# EAGLE schematic goes-to-11 (EAGLE 7.5.0)

## Sheet 1 of 2
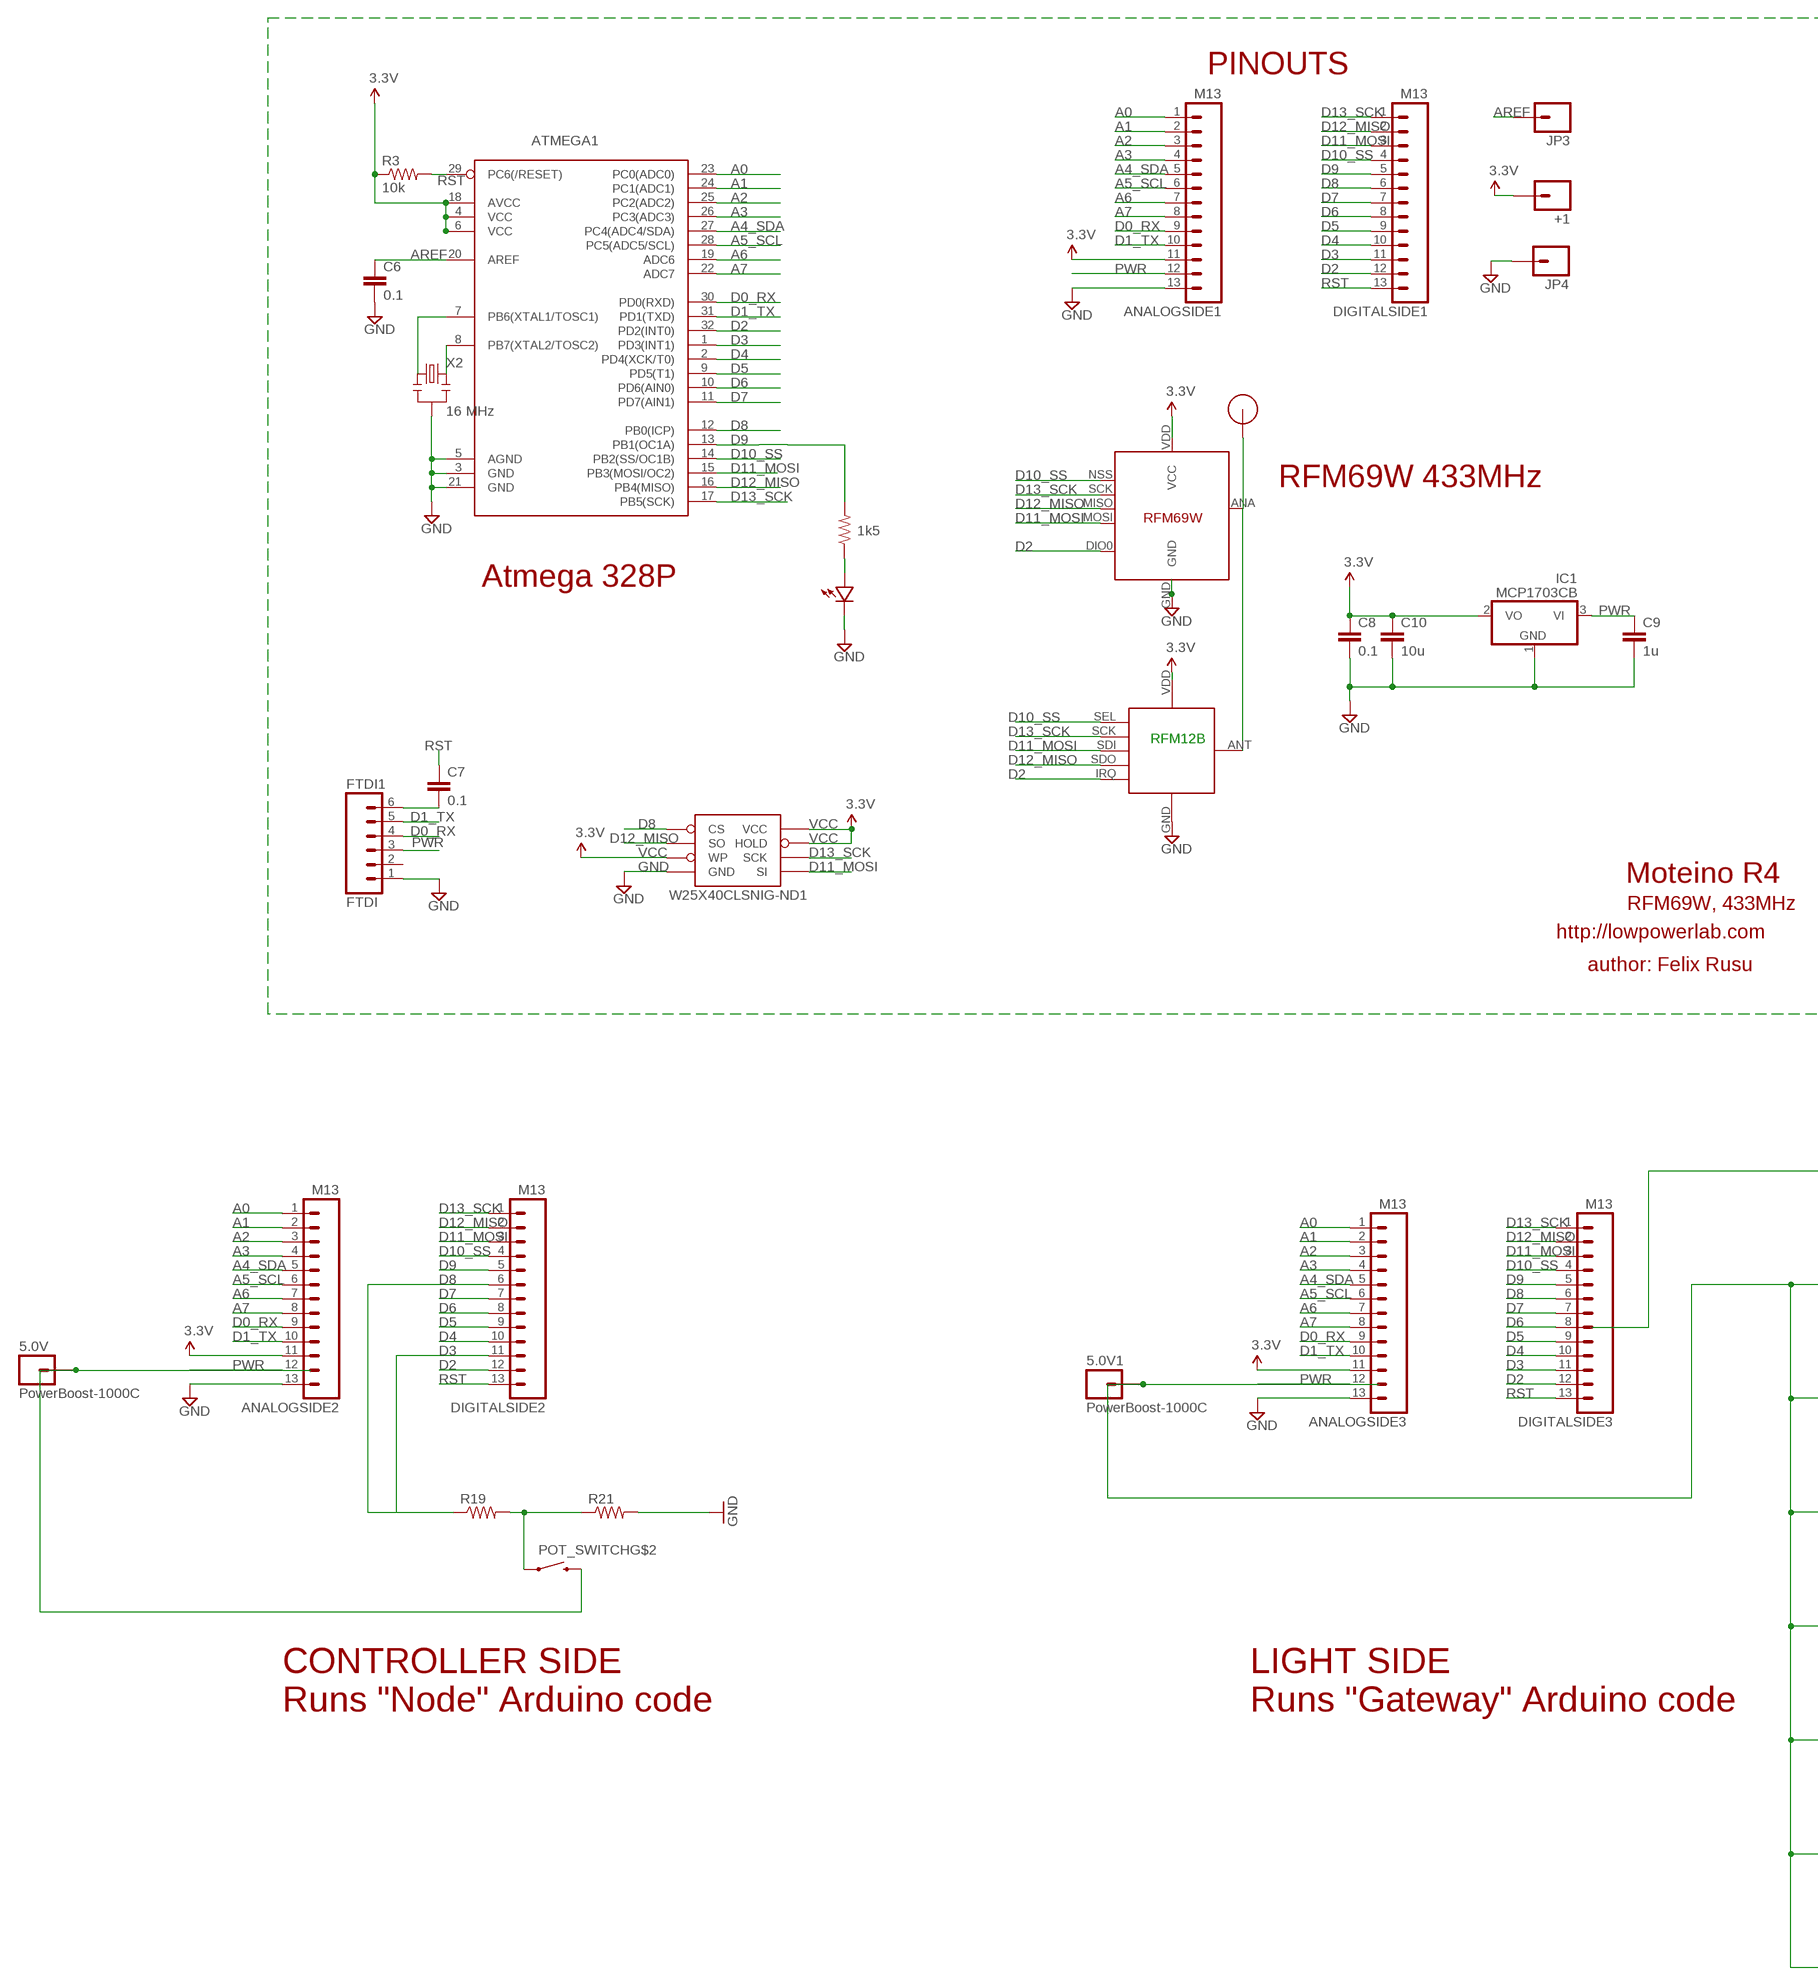
[diagram p0: schematic, sheet 1, part 1 of 2]
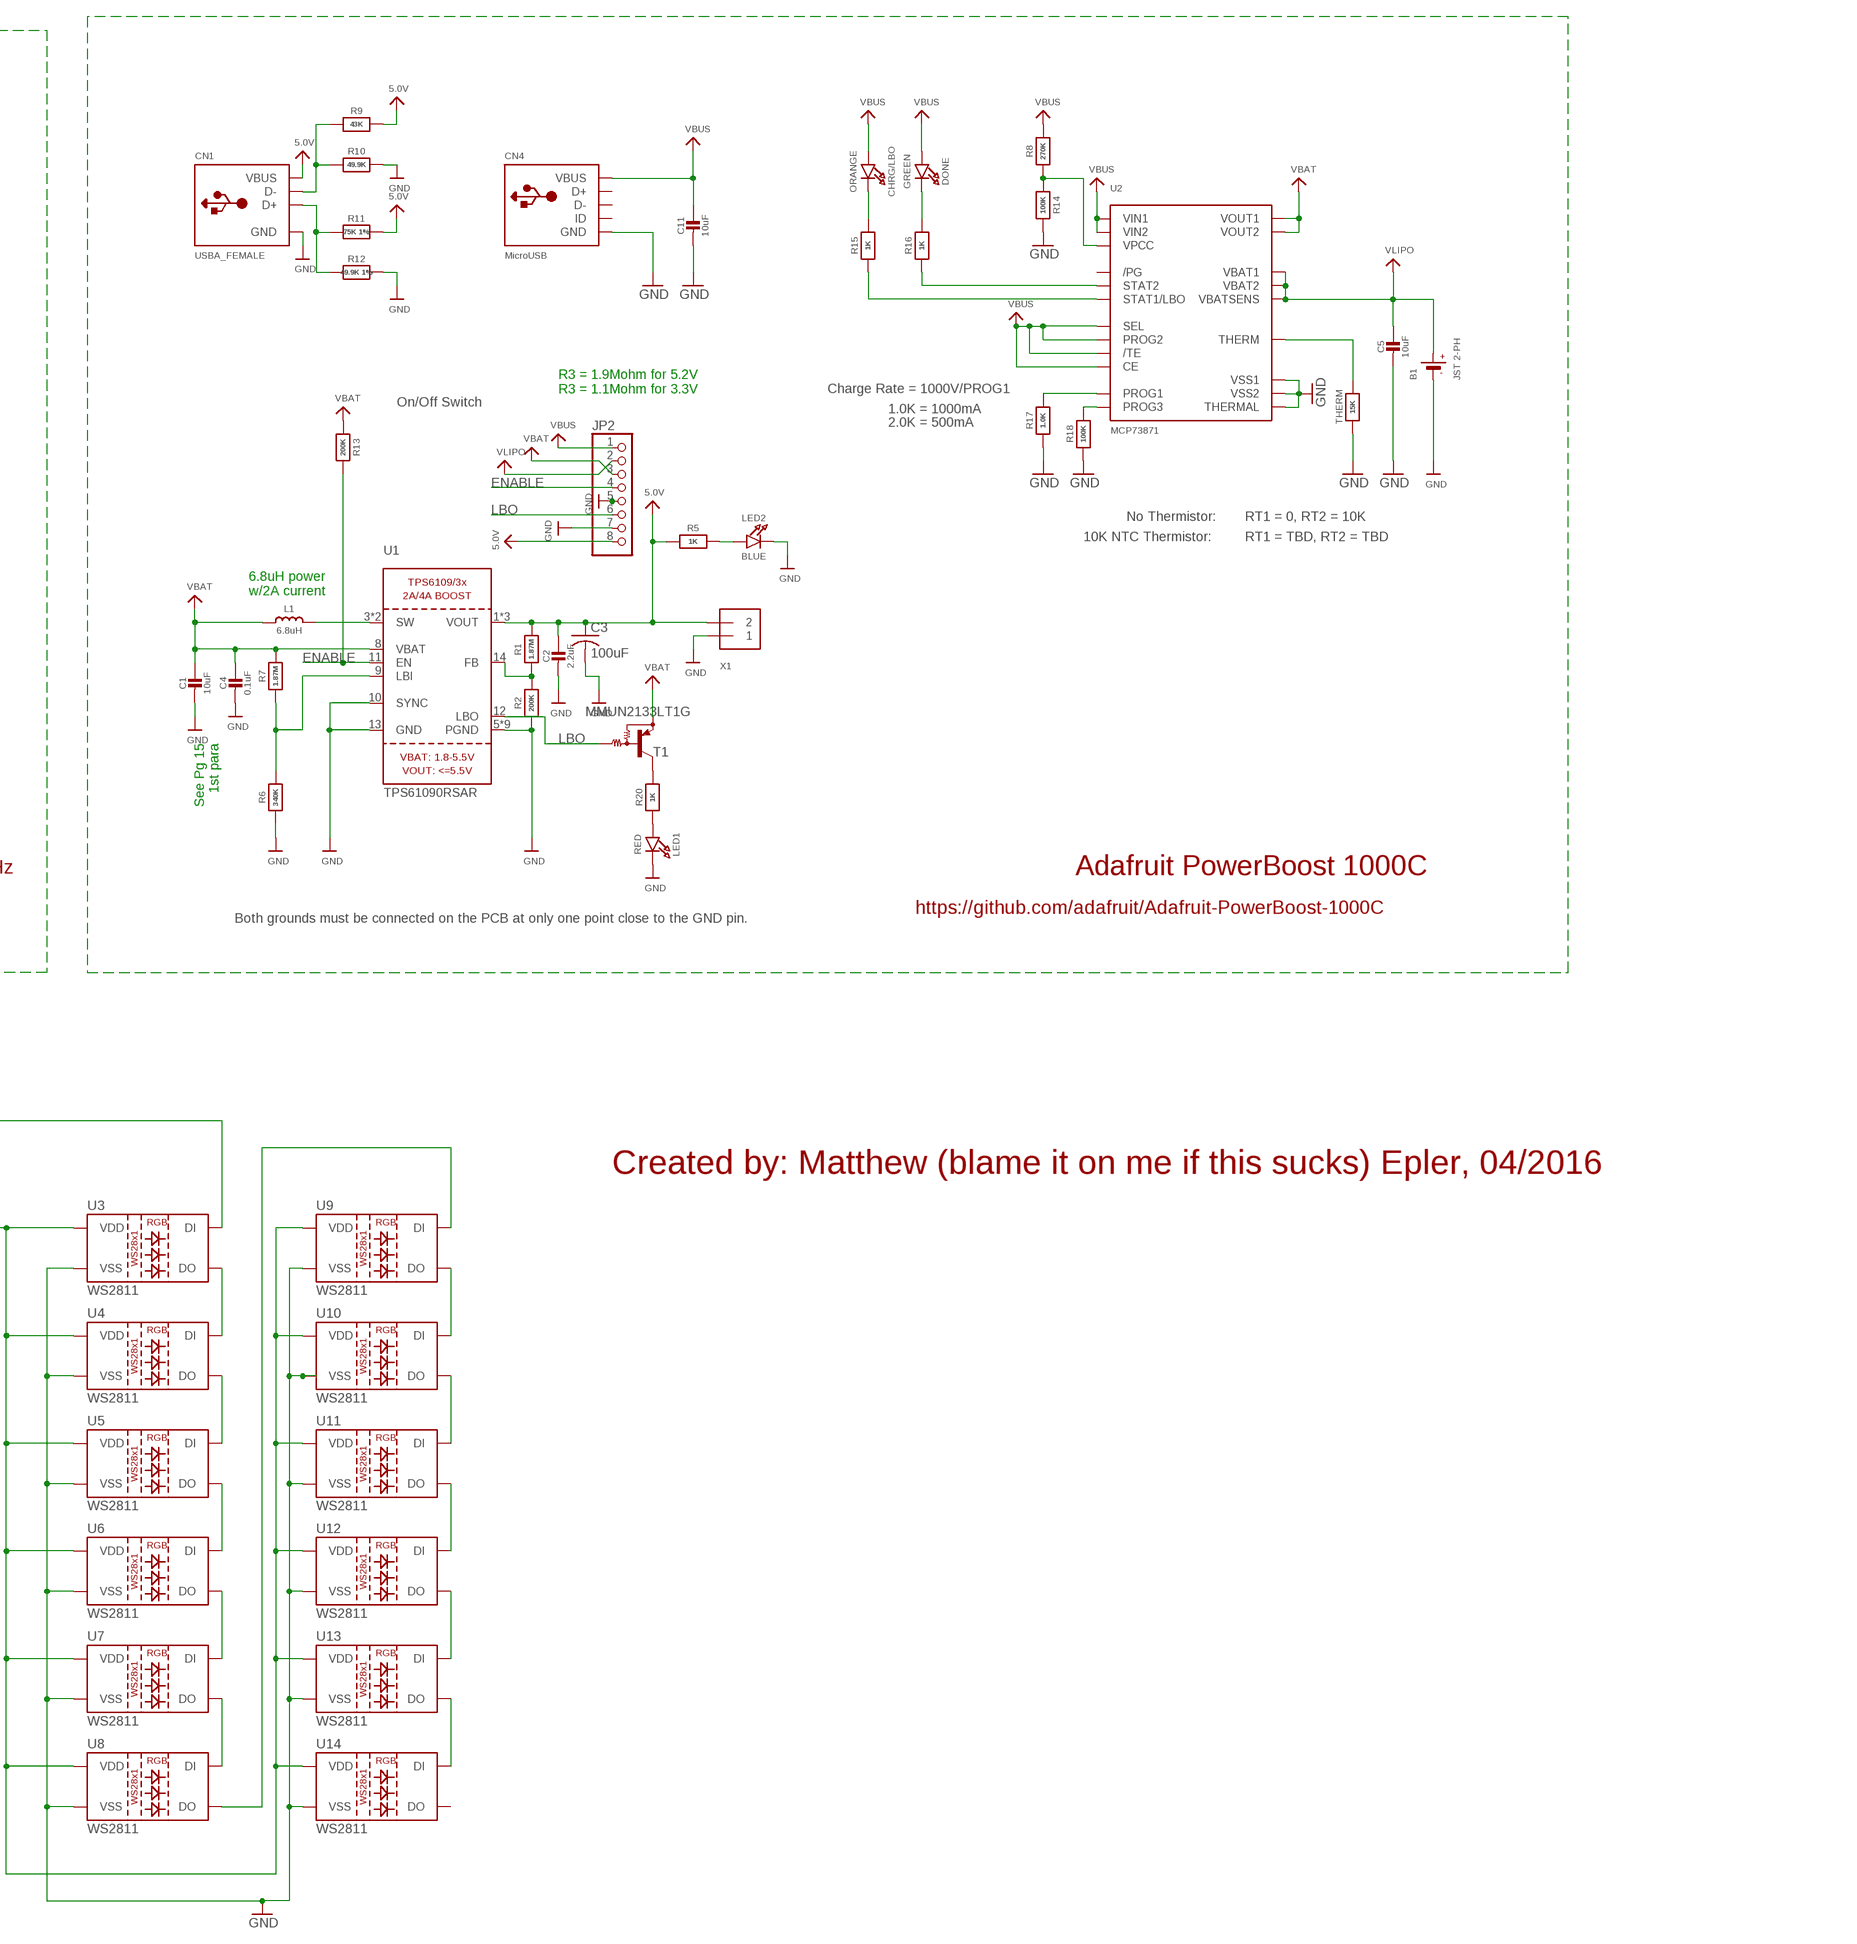
[diagram p1: schematic, sheet 1, part 2 of 2]

### Parts
5.0V  PowerBoost-1000C  M01PTH  [1X01]
5.0V1  PowerBoost-1000C  M01PTH  [1X01]
+1  M01PTH  [1X01]
ANALOGSIDE1  M13  [1X13]
ANALOGSIDE2  M13  [1X13]
ANALOGSIDE3  M13  [1X13]
ATMEGA1  ATMega-328  ATMEGA168/328TQFP32  [TQFP32-08]
B1  JST 2-PH  BATTERY  [JSTPH2]
C1  10uF  CAP_CERAMIC0805-NOOUTLINE  [0805-NO]
C2  2.2uF  CAP_CERAMIC0805-NOOUTLINE  [0805-NO]
C3  100uF  C-USC1210  [C1210]
C4  0.1uF  CAP_CERAMIC0805_10MGAP  [0805_10MGAP]
C5  10uF  CAP_CERAMIC0805-NOOUTLINE  [0805-NO]
C6  0.1  CAP0603-CAP  [0603-CAP]
C7  0.1  CAP0603-CAP  [0603-CAP]
C8  0.1  CAP0603-CAP  [0603-CAP]
C9  1u  CAP0603-CAP  [0603-CAP]
C10  10u  CAP0805-CAP  [0805-CAP]
C11  10uF  CAP_CERAMIC0805-NOOUTLINE  [0805-NO]
CHRG/LBO  ORANGE  LED0805_NOOUTLINE  [CHIPLED_0805_NOOUTLINE]
CN1  USBA_FEMALE  USB_TYPEAPTHFML  [USB_HOST-PTH]
CN4  MicroUSB  USBMICRO_20329  [4UCONN_20329]
DIGITALSIDE1  M13  [1X13]
DIGITALSIDE2  M13  [1X13]
DIGITALSIDE3  M13  [1X13]
DONE  GREEN  LED0805_NOOUTLINE  [CHIPLED_0805_NOOUTLINE]
FTDI1  FTDI  M06SIP  [1X06]
IC1  MCP1703CB  [SOT23]
JP2  HEADER-1X8ROUND  [1X08_ROUND]
JP3  M01PTH  [1X01]
JP4  M01PTH  [1X01]
L1  6.8uH  INDUCTORTDK_VLC5045  [INDUCTOR_5X5MM_TDK_VLC5045]
LED1  RED  LED0805_NOOUTLINE  [CHIPLED_0805_NOOUTLINE]
LED2  BLUE  LED0805_NOOUTLINE  [CHIPLED_0805_NOOUTLINE]
POT_SWITCH  POT_SWITCHPOT_PTH_SWITCH  [POT_PTH_SWITCH]
R1  1.87M  RESISTOR0805_NOOUTLINE  [0805-NO]
R2  200K  RESISTOR0805_NOOUTLINE  [0805-NO]
R3  10k  RESISTOR0603-RES  [0603-RES]
R4  1k5  RESISTOR0603-RES  [0603-RES]
R5  1K  RESISTOR0805_NOOUTLINE  [0805-NO]
R6  340K  RESISTOR_0805MP  [_0805MP]
R7  1.87M  RESISTOR_0805MP  [_0805MP]
R8  270K  RESISTOR0805_NOOUTLINE  [0805-NO]
R9  43K  RESISTOR0805_NOOUTLINE  [0805-NO]
R10  49.9K  RESISTOR0805_NOOUTLINE  [0805-NO]
R11  75K 1%  RESISTOR0805_NOOUTLINE  [0805-NO]
R12  49.9K 1%  RESISTOR0805_NOOUTLINE  [0805-NO]
R13  200K  RESISTOR0805_NOOUTLINE  [0805-NO]
R14  100K  RESISTOR0805_NOOUTLINE  [0805-NO]
R15  1K  RESISTOR0805_NOOUTLINE  [0805-NO]
R16  1K  RESISTOR0805_NOOUTLINE  [0805-NO]
R17  1.0K  RESISTOR0805_NOOUTLINE  [0805-NO]
R18  100K  RESISTOR0805_NOOUTLINE  [0805-NO]
R19  RESISTOREZ  [AXIAL-0.3EZ]
R20  1K  RESISTOR0805_NOOUTLINE  [0805-NO]
R21  RESISTOREZ  [AXIAL-0.3EZ]
RFM12B1  RFM12B_MINPADS  [RFM12B-MINPADS]
T1  MMUN2133LT1G  MUN2114T1-PNP_DRIVER-SC59-BEC  [SC59-BEC]
THERM  15K  RESISTOR0805_NOOUTLINE  [0805-NO]
U1  TPS61090RSAR  VREG_TPS6103X  [PVQFN-16]
U2  MCP73871  [QFN20_4MM]
U3  WS2811  LED-TRICOLOR-5050-ICWS2811  [LED-TRICOLOR-5050-IC]
U4  WS2811  LED-TRICOLOR-5050-ICWS2811  [LED-TRICOLOR-5050-IC]
U5  WS2811  LED-TRICOLOR-5050-ICWS2811  [LED-TRICOLOR-5050-IC]
U6  WS2811  LED-TRICOLOR-5050-ICWS2811  [LED-TRICOLOR-5050-IC]
U7  WS2811  LED-TRICOLOR-5050-ICWS2811  [LED-TRICOLOR-5050-IC]
U8  WS2811  LED-TRICOLOR-5050-ICWS2811  [LED-TRICOLOR-5050-IC]
U9  WS2811  LED-TRICOLOR-5050-ICWS2811  [LED-TRICOLOR-5050-IC]
U10  WS2811  LED-TRICOLOR-5050-ICWS2811  [LED-TRICOLOR-5050-IC]
U11  WS2811  LED-TRICOLOR-5050-ICWS2811  [LED-TRICOLOR-5050-IC]
U12  WS2811  LED-TRICOLOR-5050-ICWS2811  [LED-TRICOLOR-5050-IC]
U13  WS2811  LED-TRICOLOR-5050-ICWS2811  [LED-TRICOLOR-5050-IC]
U14  WS2811  LED-TRICOLOR-5050-ICWS2811  [LED-TRICOLOR-5050-IC]
U$3  LED0603  [0603-LED]
U$4  RFM12B_ANTENNA  [RFM12B-ANTENNA]
U$6  RFM69  [RFM69W-MINPADS]
W25X40CLSNIG-ND1  AT25F512BWIDE_5.3MM  [SO08WIDE]
X1  TERMBLOCK_1X2  [TERMBLOCK_1X2-3.5MM]
X2  16 MHz  RESONATORSMD  [RESONATOR-SMD]

### Nets
5.0V: C2.1 C3.1 CN1.VBUS JP2.8 R1.2 R5.1 R9.2 R11.2 U1.1(VOUT) U1.15(VOUT) U1.16(VOUT) X1.2
A0: ANALOGSIDE1.1 ANALOGSIDE2.1 ANALOGSIDE3.1 ATMEGA1.23(PC0(ADC0))
A1: ANALOGSIDE1.2 ANALOGSIDE2.2 ANALOGSIDE3.2 ATMEGA1.24(PC1(ADC1))
A2: ANALOGSIDE1.3 ANALOGSIDE2.3 ANALOGSIDE3.3 ATMEGA1.25(PC2(ADC2))
A3: ANALOGSIDE1.4 ANALOGSIDE2.4 ANALOGSIDE3.4 ATMEGA1.26(PC3(ADC3))
A4_SDA: ANALOGSIDE1.5 ANALOGSIDE2.5 ANALOGSIDE3.5 ATMEGA1.27(PC4(ADC4/SDA))
A5_SCL: ANALOGSIDE1.6 ANALOGSIDE2.6 ANALOGSIDE3.6 ATMEGA1.28(PC5(ADC5/SCL))
A6: ANALOGSIDE1.7 ANALOGSIDE2.7 ANALOGSIDE3.7 ATMEGA1.19(ADC6)
A7: ANALOGSIDE1.8 ANALOGSIDE2.8 ANALOGSIDE3.8 ATMEGA1.22(ADC7)
AREF: ATMEGA1.20(AREF) C6.1 JP3.1
D0_RX: ANALOGSIDE1.9 ANALOGSIDE2.9 ANALOGSIDE3.9 ATMEGA1.30(PD0(RXD)) FTDI1.4
D1_TX: ANALOGSIDE1.10 ANALOGSIDE2.10 ANALOGSIDE3.10 ATMEGA1.31(PD1(TXD)) FTDI1.5
D2: ATMEGA1.32(PD2(INT0)) DIGITALSIDE1.12 DIGITALSIDE2.12 DIGITALSIDE3.12 RFM12B1.IRQ U$6.DIO0
D3: ATMEGA1.1(PD3(INT1)) DIGITALSIDE1.11 DIGITALSIDE2.11 DIGITALSIDE3.11
D4: ATMEGA1.2(PD4(XCK/T0)) DIGITALSIDE1.10 DIGITALSIDE2.10 DIGITALSIDE3.10
D5: ATMEGA1.9(PD5(T1)) DIGITALSIDE1.9 DIGITALSIDE2.9 DIGITALSIDE3.9
D6: ATMEGA1.10(PD6(AIN0)) DIGITALSIDE1.8 DIGITALSIDE2.8 DIGITALSIDE3.8
D7: ATMEGA1.11(PD7(AIN1)) DIGITALSIDE1.7 DIGITALSIDE2.7 DIGITALSIDE3.7
D8: ATMEGA1.12(PB0(ICP)) DIGITALSIDE1.6 DIGITALSIDE2.6 DIGITALSIDE3.6 R19.P$1 W25X40CLSNIG-ND1.1(CS)
D9: ATMEGA1.13(PB1(OC1A)) DIGITALSIDE1.5 DIGITALSIDE2.5 DIGITALSIDE3.5 R4.2
D10_SS: ATMEGA1.14(PB2(SS/OC1B)) DIGITALSIDE1.4 DIGITALSIDE2.4 DIGITALSIDE3.4 RFM12B1.SEL U$6.NSS(SEL)
D11_MOSI: ATMEGA1.15(PB3(MOSI/OC2)) DIGITALSIDE1.3 DIGITALSIDE2.3 DIGITALSIDE3.3 RFM12B1.SDI(SDI/MOSI) U$6.MOSI W25X40CLSNIG-ND1.5(SI)
D12_MISO: ATMEGA1.16(PB4(MISO)) DIGITALSIDE1.2 DIGITALSIDE2.2 DIGITALSIDE3.2 RFM12B1.SDO(SDO/MISO) U$6.MISO W25X40CLSNIG-ND1.2(SO)
D13_SCK: ATMEGA1.17(PB5(SCK)) DIGITALSIDE1.1 DIGITALSIDE2.1 DIGITALSIDE3.1 RFM12B1.SCK U$6.SCK W25X40CLSNIG-ND1.6(SCK)
D+: CN1.D+ R11.1 R12.1
D-: CN1.D- R9.1 R10.1
ENABLE: JP2.4 R13.2 U1.11(EN)
GND [power]: ANALOGSIDE1.13 ANALOGSIDE2.13 ANALOGSIDE3.13 ATMEGA1.3(GND) ATMEGA1.5(AGND) ATMEGA1.21(GND) B1.1(-) C1.2 C2.2 C3.2 C4.2 C5.2 C6.2 C8.2 C9.2 C10.2 C11.2 CN1.GND CN4.BASE@1(GND) CN4.BASE@2(GND) CN4.GND CN4.SPRT@1(GND) CN4.SPRT@2(GND) CN4.SPRT@3(GND) CN4.SPRT@4(GND) FTDI1.1 IC1.1(GND) JP2.5 JP2.7 JP4.1 LED1.C LED2.C R2.1 R6.1 R10.2 R12.2 R14.2 R17.1 R18.1 R21.P$2 RFM12B1.GND THERM.1 U1.5(PGND) U1.6(PGND) U1.7(PGND) U1.10(SYNC) U1.13(GND) U1.P$18(PGND) U1.P$19(PGND) U1.P$20(PGND) U1.P$21(PGND) U1.P$22(PGND) U1.THERMAL(PGND) U2.P$10(VSS1) U2.P$11(VSS2) U2.P$21(THERMAL) U3.6(VSS) U4.6(VSS) U5.6(VSS) U6.6(VSS) U7.6(VSS) U8.6(VSS) U9.6(VSS) U10.6(VSS) U11.6(VSS) U12.6(VSS) U13.6(VSS) U14.6(VSS) U$3.MINUS U$6.GND W25X40CLSNIG-ND1.4(GND) X1.1 X2.2
LBO: JP2.6 T1.B U1.12(LBO)
N$1: L1.P$2 U1.3(SW) U1.4(SW)
N$2: LED1.A R20.1
N$3: R6.2 R7.1 U1.9(LBI)
N$4: R1.1 R2.2 U1.14(FB)
N$5: ATMEGA1.7(PB6(XTAL1/TOSC1)) X2.1
N$6: ATMEGA1.8(PB7(XTAL2/TOSC2)) X2.3
N$7: C7.2 FTDI1.6
N$8: R4.1 U$3.PLUS
N$9: RFM12B1.ANT U$4.P$1 U$6.ANA(ANT)
N$11: R20.2 T1.C
N$12: LED2.A R5.2
N$13: R8.1 R14.1 U2.P$2(VPCC)
N$14: R16.1 U2.P$7(STAT2)
N$15: R15.1 U2.P$8(STAT1/LBO)
N$16: R17.2 U2.P$13(PROG1)
N$17: THERM.2 U2.P$5(THERM)
N$18: DONE.C R16.2
N$19: CHRG/LBO.C R15.2
N$20: R18.2 U2.P$12(PROG3)
N$22: 5.0V.1 POT_SWITCH.S2
N$23: POT_SWITCH.S1 R19.P$2 R21.P$1
N$24: U3.2(DI)
N$25: U3.1(DO) U4.2(DI)
N$26: 5.0V1.1 U3.3(VDD) U3.5(VDD) U4.3(VDD) U4.5(VDD) U5.3(VDD) U5.5(VDD) U6.3(VDD) U6.5(VDD) U7.3(VDD) U7.5(VDD) U8.3(VDD) U8.5(VDD) U9.3(VDD) U9.5(VDD) U10.3(VDD) U10.5(VDD) U11.3(VDD) U11.5(VDD) U12.3(VDD) U12.5(VDD) U13.3(VDD) U13.5(VDD) U14.3(VDD) U14.5(VDD)
N$27: U4.1(DO) U5.2(DI)
N$28: U5.1(DO) U6.2(DI)
N$29: U6.1(DO) U7.2(DI)
N$30: U7.1(DO) U8.2(DI)
N$31: U8.1(DO) U9.2(DI)
N$32: U9.1(DO) U10.2(DI)
N$33: U10.1(DO) U11.2(DI)
N$34: U11.1(DO) U12.2(DI)
N$35: U12.1(DO) U13.2(DI)
N$36: U13.1(DO) U14.2(DI)
PWR [power]: ANALOGSIDE1.12 ANALOGSIDE2.12 ANALOGSIDE3.12 C9.1 FTDI1.3 IC1.3(VI)
RST: ATMEGA1.29(PC6(/RESET)) C7.1 DIGITALSIDE1.13 DIGITALSIDE2.13 DIGITALSIDE3.13 R3.2
VBAT: C1.1 C4.1 JP2.3 L1.P$1 R7.2 R13.1 T1.E U1.8(VBAT) U2.P$1(VOUT1) U2.P$20(VOUT2)
VBUS: C11.1 CHRG/LBO.A CN4.VBUS DONE.A JP2.1 R8.2 U2.P$3(SEL) U2.P$4(PROG2) U2.P$9(/TE) U2.P$17(CE) U2.P$18(VIN1) U2.P$19(VIN2)
VCC: +1.1 ANALOGSIDE1.11 ANALOGSIDE2.11 ANALOGSIDE3.11 ATMEGA1.4(VCC) ATMEGA1.6(VCC) ATMEGA1.18(AVCC) C8.1 C10.1 IC1.2(VO) R3.1 RFM12B1.VDD U$6.VDD(VCC) W25X40CLSNIG-ND1.3(WP) W25X40CLSNIG-ND1.7(HOLD) W25X40CLSNIG-ND1.8(VCC) ; supply symbol labelled 3.3V
VLIPO: B1.2(+) C5.1 JP2.2 U2.P$14(VBAT1) U2.P$15(VBAT2) U2.P$16(VBATSENS)
Unconnected: CN4.D+ CN4.D- CN4.ID FTDI1.2 POT_SWITCH.1(A) POT_SWITCH.2(S) POT_SWITCH.3(E) U2.P$6(/PG) U14.1(DO)

### Notes on the sheet
- PINOUTS
- R3 = 1.9Mohm for 5.2V
  R3 = 1.1Mohm for 3.3V
- Charge Rate = 1000V/PROG1
- On/Off Switch
- 1.0K = 1000mA
- 2.0K = 500mA
- RFM69W 433MHz
- No Thermistor: | RT1 = 0, RT2 = 10K
- 10K NTC Thermistor: | RT1 = TBD, RT2 = TBD
- Atmega 328P
- 6.8uH power
  w/2A current
- RFM12B
- See Pg 15
  1st para
- Moteino R4
- RFM69W, 433MHz | Adafruit PowerBoost 1000C
- http://lowpowerlab.com
- https://github.com/adafruit/Adafruit-PowerBoost-1000C
- Both grounds must be connected on the PCB at only one point close to the GND pin.
- author: Felix Rusu
- Created by: Matthew (blame it on me if this sucks) Epler, 04/2016
- CONTROLLER SIDE 
  Runs "Node" Arduino code
- LIGHT SIDE 
  Runs "Gateway" Arduino code

## Sheet 2 of 2

## Library data of the parts
5.0V 5.0V1 +1 JP3 JP4 = SparkFun-Connectors:M01: Header 1 Standard 1-pin 0.1" header. Use with straight break away headers (SKU : PRT-00116), right angle break away headers (PRT-00553), swiss pins (PRT-00743), machine pins (PRT-00117), and female headers (PRT-00115). SMTSO-256-ET is a "flush mount" nut for a 4-40 screw. The older package used to be too tight, and did not allow it to sit properly thru the drill hit. The latest (0.165DIA) fits nice and snug.
ANALOGSIDE1-ANALOGSIDE3 DIGITALSIDE1-DIGITALSIDE3 = SparkFun-Connectors:M13: 13-pin single row .1" header
ATMEGA1 = LowPowerLab:ATMEGA168/328: Atmel 32-pin 8-bit micro, 16k flash.
B1 = microbuilder:BATTERY: CR1220 SMT - Digikey: 3001K-ND CD2032 BAT-HLD-001 - Digikey: BAT-HLD-001-ND
C1 C2 C4 C5 C11 = microbuilder:CAP_CERAMIC: Ceramic Capacitors For new designs, use the packages preceded by an '_' character since they are more reliable: The following footprints should be used on most boards: _0402 - Standard footprint for regular board layouts _0603 - Standard footprint for regular board layouts _0805 - Standard footprint for regular board layouts _1206 - Standard footprint for regular board layouts For extremely tight-pitch boards where space is at a premium, the following 'micro-pitch' footprints can be used (smaller pads, no silkscreen outline, etc.): _0402MP - Micro-pitch footprint for very dense/compact boards _0603MP - Micro-pitch footprint for very dense/compact boards _0805MP - Micro-pitch footprint for very dense/compact boards _1206MP - Micro-pitch footprint for very dense/compact boards
C3 = rcl:C-US: CAPACITOR, American symbol
C6-C10 = LowPowerLab:CAP: Capacitor Standard 0603 ceramic capacitor, and 0.1" leaded capacitor.
CHRG/LBO DONE LED1 LED2 = microbuilder:LED: LED 0603 - 0603 Surface Mount Package 2mA: Green LED - Low Power (3.9mcd, 2ma, 1.7Vf) - Digikey: 475-2709-2-ND Orange LED - Low Power (9.8mcd, 2ma, 1.8Vf) - Digikey: 475-1194-2-ND Red LED - Low Power (5mcd, 2ma, 1.8Vf) - Digikey: 475-1195-2-ND Yellow LED - Low Power (7mcd, 2ma, 1.8Vf) - Digikey: 475-1196-2-ND 5mA: Blue LED - Low Power (17mcd, 5ma, 2.9Vf) - Digikey: LNJ937W8CRACT-ND 0805 - 0805 Surface Mount Package 2mA: Red LED (8.8mcd, 2mA, 1.8Vf, Clear) - Low Power [Digikey: 475-2510-1-ND] Green LED (5mcd, 2mA, 1.8Vf, Clear) - Low Power [Digikey: 475-2730-1-ND] Yellow LED (11.3mcd, 2mA, 1.8Vf, Clear) - Low Power [Digikey: 475-2555-1-ND] 20mA: Red LED (104mcd, 20mA, Diffused) - LS R976 [Digikey: 475-1278-6-ND] Red LED (12mcd, 20mA, 2.0Vf, Clear) - APT2012EC [Digikey: 754-1128-1-ND] Green LED (15mcd, 20mA, 2.2Vf, Clear) - APT2012GC [Digikey: 754-1131-1-ND] Orange LED (160mcd, 20mA, 2.1Vf, Clear) - APT2012SECK [Digikey: 754-1130-1-ND] 1206 - 1206 Surface Mount Package Green LED (26mcd, 20mA, Diffused) - LG N971 [Digikey: 475-1407-6-ND] Red LED (15mcd, 20mA, Diffused) - LH N974 [Digikey: 475-1416-6-ND] Cree - Cree High-Power Surface Mount LEDs XPEBWT-L1-0000-00D50 - White 111lm 350mA 2.9Vf 6200K 110° XTEAWT-00-0000-00000LEE3 - White 114lm 350mA 2.85Vf 5000K 115° Everlight - Everlight 45-21 Series Surface Mount LEDs 45-21/QK2C-B2832AC2CB2/2T - Warm White 2000mcd 20mA 3.25Vf 3050K 120° 45-21/LK2C-B38452C4CB2/2T - Nuetral White 2000mcd 20mA 3.25Vf 4150K 120° 45-21/LK2C-B50634C6CB2/2T - Cold White 2200mcd 20mA 3.25Vf 5650K 120° PLCC2 Reverse Mount LS T77K-J1L2-1-0-2-R18-Z - Red 11.25mcd 2mA 1.8Vf 630nm 120° LO T77K-L1M2-24-Z - Orange 19.6mcd 2mA 1.8Vf 606nm 120° LY T77K-K2M1-26-Z - Yellow 15.7mcd 2mA 1.8Vf 587nm 120°
CN1 = microbuilder:USB_TYPEA: USB - Type A Connectors Male types stick out and are inserted into a PC or matching females parts (these are the connectors used on USB Memory Sticks, etc.). Female parts are generally used for USB Host and accept a male-type connector. SMT - 4UCON: 10017 PTHFML - Digikey: 609-1045-ND, 4UCon: 05241 PCB - Use 2.0mm thick PCBs with this footprint
CN4 = microbuilder:USB: USB Connectors USBMINIB - Surface Mount Female Mini-B USB Connector 4UConnector: 06564
FTDI1 = SparkFun-Connectors:M06: Header 6 Standard 6-pin 0.1" header. Use with straight break away headers (SKU : PRT-00116), right angle break away headers (PRT-00553), swiss pins (PRT-00743), machine pins (PRT-00117), and female headers (PRT-00115). Molex polarized connector foot print use with SKU : PRT-08094 with associated crimp pins and housings. NOTES ON THE VARIANTS LOCK and LOCK_LONGPADS... This footprint was designed to help hold the alignment of a through-hole component (i.e. 6-pin header) while soldering it into place. You may notice that each hole has been shifted either up or down by 0.005 of an inch from it's more standard position (which is a perfectly straight line). This slight alteration caused the pins (the squares in the middle) to touch the edges of the holes. Because they are alternating, it causes a "brace" to hold the component in place. 0.005 has proven to be the perfect amount of "off-center" position when using our standard breakaway headers. Although looks a little odd when you look at the bare footprint, once you have a header in there, the alteration is very hard to notice. Also, if you push a header all the way into place, it is covered up entirely on the bottom side. This idea of altering the position of holes to aid alignment will be further integrated into the Sparkfun Library for other footprints. It can help hold any component with 3 or more connection pins.
IC1 = linear:MCP1703: 250 mA, 16V, Low Quiescent Current LDO Regulator Source: http://ww1.microchip.com/downloads/en/DeviceDoc/22049b.pdf
JP2 = microbuilder:HEADER-1X8: PIN HEADER
L1 = microbuilder:INDUCTOR: Inductors 0603: 10nH Ceramic Inductor - microwire antenna/RF (Digikey: 712-1434-2-ND) 0805: 560nH Ceramic Inductor - RF (Digikey: 553-1047-1-ND) 270nH Ceramic Inductor - Q = 40@250MHz, +-5%, 1 Ohm DC Resistance (Digikey: 535-10506-2-ND) 1007 (2518 Metric) SMT: 10µH 10% 250mOhm 820mA 1007 Inductor (Digikey: 587-2189-1-ND) 22µH 10% 500mOhm 580mA 1007 Inductor (Digikey: 587-2190-1-ND) 47µH 10% 950mOhm 420mA 1007 Inductor (Digikey: 587-2191-1-ND) 47µH 5% 100mOhm 1A 1008 Inductor (Digikey: 732-1816-1-ND) 5.0x5.0mm (Taiyo Yuden NR5040 Series) 6.8µH 20% 2.3A 64mOhm Inductor (Digikey: 587-2374-2-ND) 5.0x5.0mm (TDK VLC5045 Series) 4.7µH 20% 3.3A 34mOhm Inductor (Digikey: 445-6526-1-ND) 6.8µH 20% 2.7A 46mOhm Inductor (Digikey: 445-6527-1-ND) 6.0x6.0mm (TDK VLC6045 Series) 4.7µH 20% 3.8A 27mOhm Inductor (Digikey: 445-6538-2-ND) 6.8µH 20% 3A 41mOhm Inductor (Digikey: 445-6540-1-ND) 6.2µH 30% 2.2A 45mOhm Inductor (Digikey: SRR5028-6R2YCT-ND) - Not TDK VLC6045 but footprint should match 6.0x6.0mm (TDK SLF6045 Series) 6.8uH 30% 2A 33mOhm Inductor (Digikey: 445-4572-1-ND, Mouser: 810-SLF645T6R8N2R0PF) 6.0x6.0mm (Sumida CDRH5D28 Series) 6.2uH 30% 1.8A 45mOhm Inductor (Digikey: 308-1542-1-ND) Taiyo Yuden NR3015T2R2M - 2.2uH 20% 1.5A (Digikey: 587-1648-2-ND, Mouser: 963-NR3015T2R2M) - Used with TI TPS62172 CoilCraft RFID Transponder Coil - MA5532-AE (For use with AS3935 Lightning Sensor) Vishay IHLP 1.0uH Molded Inductor - 24mOhm DCR, 5A, +/-20%, -55°C-125°C (Digikey: 541-1319-1-ND)
POT_SWITCH = SparkFun-Electromechanical:POT_SWITCH: Potentiometer w/ switch.
R1 R2 R5-R18 R20 THERM = microbuilder:RESISTOR: Resistors For new designs, use the packages preceded by an '_' character since they are more reliable: The following footprints should be used on most boards: _0402 - Standard footprint for regular board layouts _0603 - Standard footprint for regular board layouts _0805 - Standard footprint for regular board layouts _1206 - Standard footprint for regular board layouts For extremely tight-pitch boards where space is at a premium, the following 'micro-pitch' footprints can be used (smaller pads, no silkscreen outline, etc.): _0402MP - Micro-pitch footprint for very dense/compact boards _0603MP - Micro-pitch footprint for very dense/compact boards _0805MP - Micro-pitch footprint for very dense/compact boards _1206MP - Micro-pitch footprint for very dense/compact boards
R3 R4 = LowPowerLab:RESISTOR: Resistor Basic schematic elements and footprints for 0603, 1206, and PTH resistors.
R19 R21 = SparkFun-Passives:RESISTOR: Resistor Basic schematic elements and footprints for 0603, 1206, and PTH resistors.
RFM12B1 = LowPowerLab:RFM12B_MINPADS
T1 = transistor:*-PNP_DRIVER-: PNP Bias Resistor Transistor
U1 = microbuilder:VREG_TPS6103X: TPS6103x 4A Boost - 1.8-5.5V Input, Adjustable Output to 5.5V
U2 = microbuilder:MCP73871: MCP73871 Lithium Polymer Battery Charger Digikey: MCP73871-2CCI/ML-ND
U3-U14 = SparkFun-LED:LED-TRICOLOR-5050-IC: WS2812 RGB LED w/ WS2811 driver 5x5mm SMD LED with built-in controller IC. DIO-11598; PROD_ID: DIO-11598
U$3 = LowPowerLab:LED
U$4 = LowPowerLab:RFM12B_ANTENNA
U$6 = LowPowerLab:RFM69
W25X40CLSNIG-ND1 = LowPowerLab:AT25F512B: 4-Mbit SPI flash memory
X1 = microbuilder:TERMBLOCK_1X2: 3.5mm Terminal block http://www.ladyada.net/library/pcb/eaglelibrary.html
X2 = SparkFun:RESONATOR: Resonator Small SMD resonator. This is the itty bitty 10/20MHz resonators with built in caps. CSTCE10M0G55 and CSTCE20M0V53. Footprint has been reviewed closely but hasn't been tested yet.

## Net classes
1 power: width 0.381 mm, clearance 0.254 mm